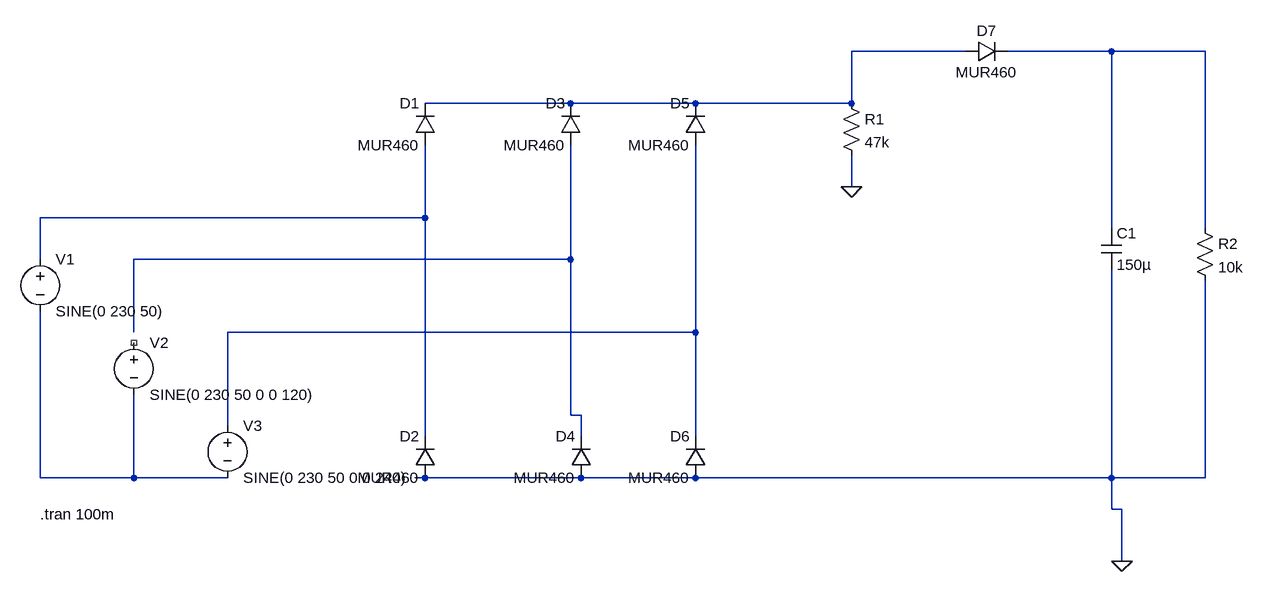
[diagram p0: schematic fefggrg.asc]
fefggrg.asc, the LTspice schematic file:
Version 4
SHEET 1 1684 680
WIRE 1248 -288 1072 -288
WIRE 1472 -288 1312 -288
WIRE 1616 -288 1472 -288
WIRE 640 -208 416 -208
WIRE 832 -208 640 -208
WIRE 1072 -208 1072 -288
WIRE 1072 -208 832 -208
WIRE 1072 -80 1072 -128
WIRE 416 -32 416 -144
WIRE 416 -32 -176 -32
WIRE 1472 -16 1472 -288
WIRE 1616 -16 1616 -288
WIRE -176 32 -176 -32
WIRE 640 32 640 -144
WIRE 640 32 -32 32
WIRE -32 144 -32 32
WIRE 832 144 832 -144
WIRE 832 144 112 144
WIRE 640 272 640 32
WIRE 656 272 640 272
WIRE 112 288 112 144
WIRE 416 304 416 -32
WIRE 656 304 656 272
WIRE 832 304 832 144
WIRE -176 368 -176 112
WIRE -32 368 -32 240
WIRE -32 368 -176 368
WIRE 112 368 -32 368
WIRE 416 368 400 368
WIRE 656 368 416 368
WIRE 832 368 656 368
WIRE 1472 368 1472 48
WIRE 1472 368 832 368
WIRE 1616 368 1616 64
WIRE 1616 368 1472 368
WIRE 1472 416 1472 368
WIRE 1488 416 1472 416
WIRE 1488 496 1488 416
FLAG 1072 -80 0
FLAG 1488 496 0
SYMBOL voltage -176 16 R0
WINDOW 123 0 0 Left 0
WINDOW 39 0 0 Left 0
SYMATTR InstName V1
SYMATTR Value SINE(0 230 50)
SYMBOL voltage -32 144 R0
WINDOW 123 0 0 Left 0
WINDOW 39 0 0 Left 0
SYMATTR InstName V2
SYMATTR Value SINE(0 230 50 0 0 120)
SYMBOL voltage 112 272 R0
WINDOW 123 0 0 Left 0
WINDOW 39 0 0 Left 0
SYMATTR InstName V3
SYMATTR Value SINE(0 230 50 0 0 240)
SYMBOL diode 432 -144 R180
WINDOW 0 24 64 Left 2
WINDOW 3 24 0 Left 2
SYMATTR InstName D1
SYMATTR Value MUR460
SYMBOL diode 432 368 R180
WINDOW 0 24 64 Left 2
WINDOW 3 24 0 Left 2
SYMATTR InstName D2
SYMATTR Value MUR460
SYMBOL diode 656 -144 R180
WINDOW 0 24 64 Left 2
WINDOW 3 24 0 Left 2
SYMATTR InstName D3
SYMATTR Value MUR460
SYMBOL diode 672 368 R180
WINDOW 0 24 64 Left 2
WINDOW 3 24 0 Left 2
SYMATTR InstName D4
SYMATTR Value MUR460
SYMBOL diode 848 -144 R180
WINDOW 0 24 64 Left 2
WINDOW 3 24 0 Left 2
SYMATTR InstName D5
SYMATTR Value MUR460
SYMBOL diode 848 368 R180
WINDOW 0 24 64 Left 2
WINDOW 3 24 0 Left 2
SYMATTR InstName D6
SYMATTR Value MUR460
SYMBOL diode 1248 -272 R270
WINDOW 0 32 32 VTop 2
WINDOW 3 0 32 VBottom 2
SYMATTR InstName D7
SYMATTR Value MUR460
SYMBOL res 1056 -224 R0
SYMATTR InstName R1
SYMATTR Value 47k
SYMBOL cap 1456 -16 R0
SYMATTR InstName C1
SYMATTR Value 150µ
SYMBOL res 1600 -32 R0
SYMATTR InstName R2
SYMATTR Value 10k
TEXT -176 424 Left 2 !.tran 100m

The netlist it stands for:
* fefggrg.asc
V1 N003 N006 SINE(0 230 50)
V2 NC_01 N006 SINE(0 230 50 0 0 120)
V3 N005 N006 SINE(0 230 50 0 0 240)
D1 N003 N001 MUR460
D2 0 N003 MUR460
D3 N004 N001 MUR460
D4 0 N004 MUR460
D5 N005 N001 MUR460
D6 0 N005 MUR460
D7 N001 N002 MUR460
R1 N001 0 47k
C1 N002 0 150µ
R2 N002 0 10k
.model D D
.lib standard.dio
.tran 100m
.backanno
.end